# Altium schematic sheet ST1S40IDR.SchDoc
size A3; SheetNumber: 3; SheetTotal: 7
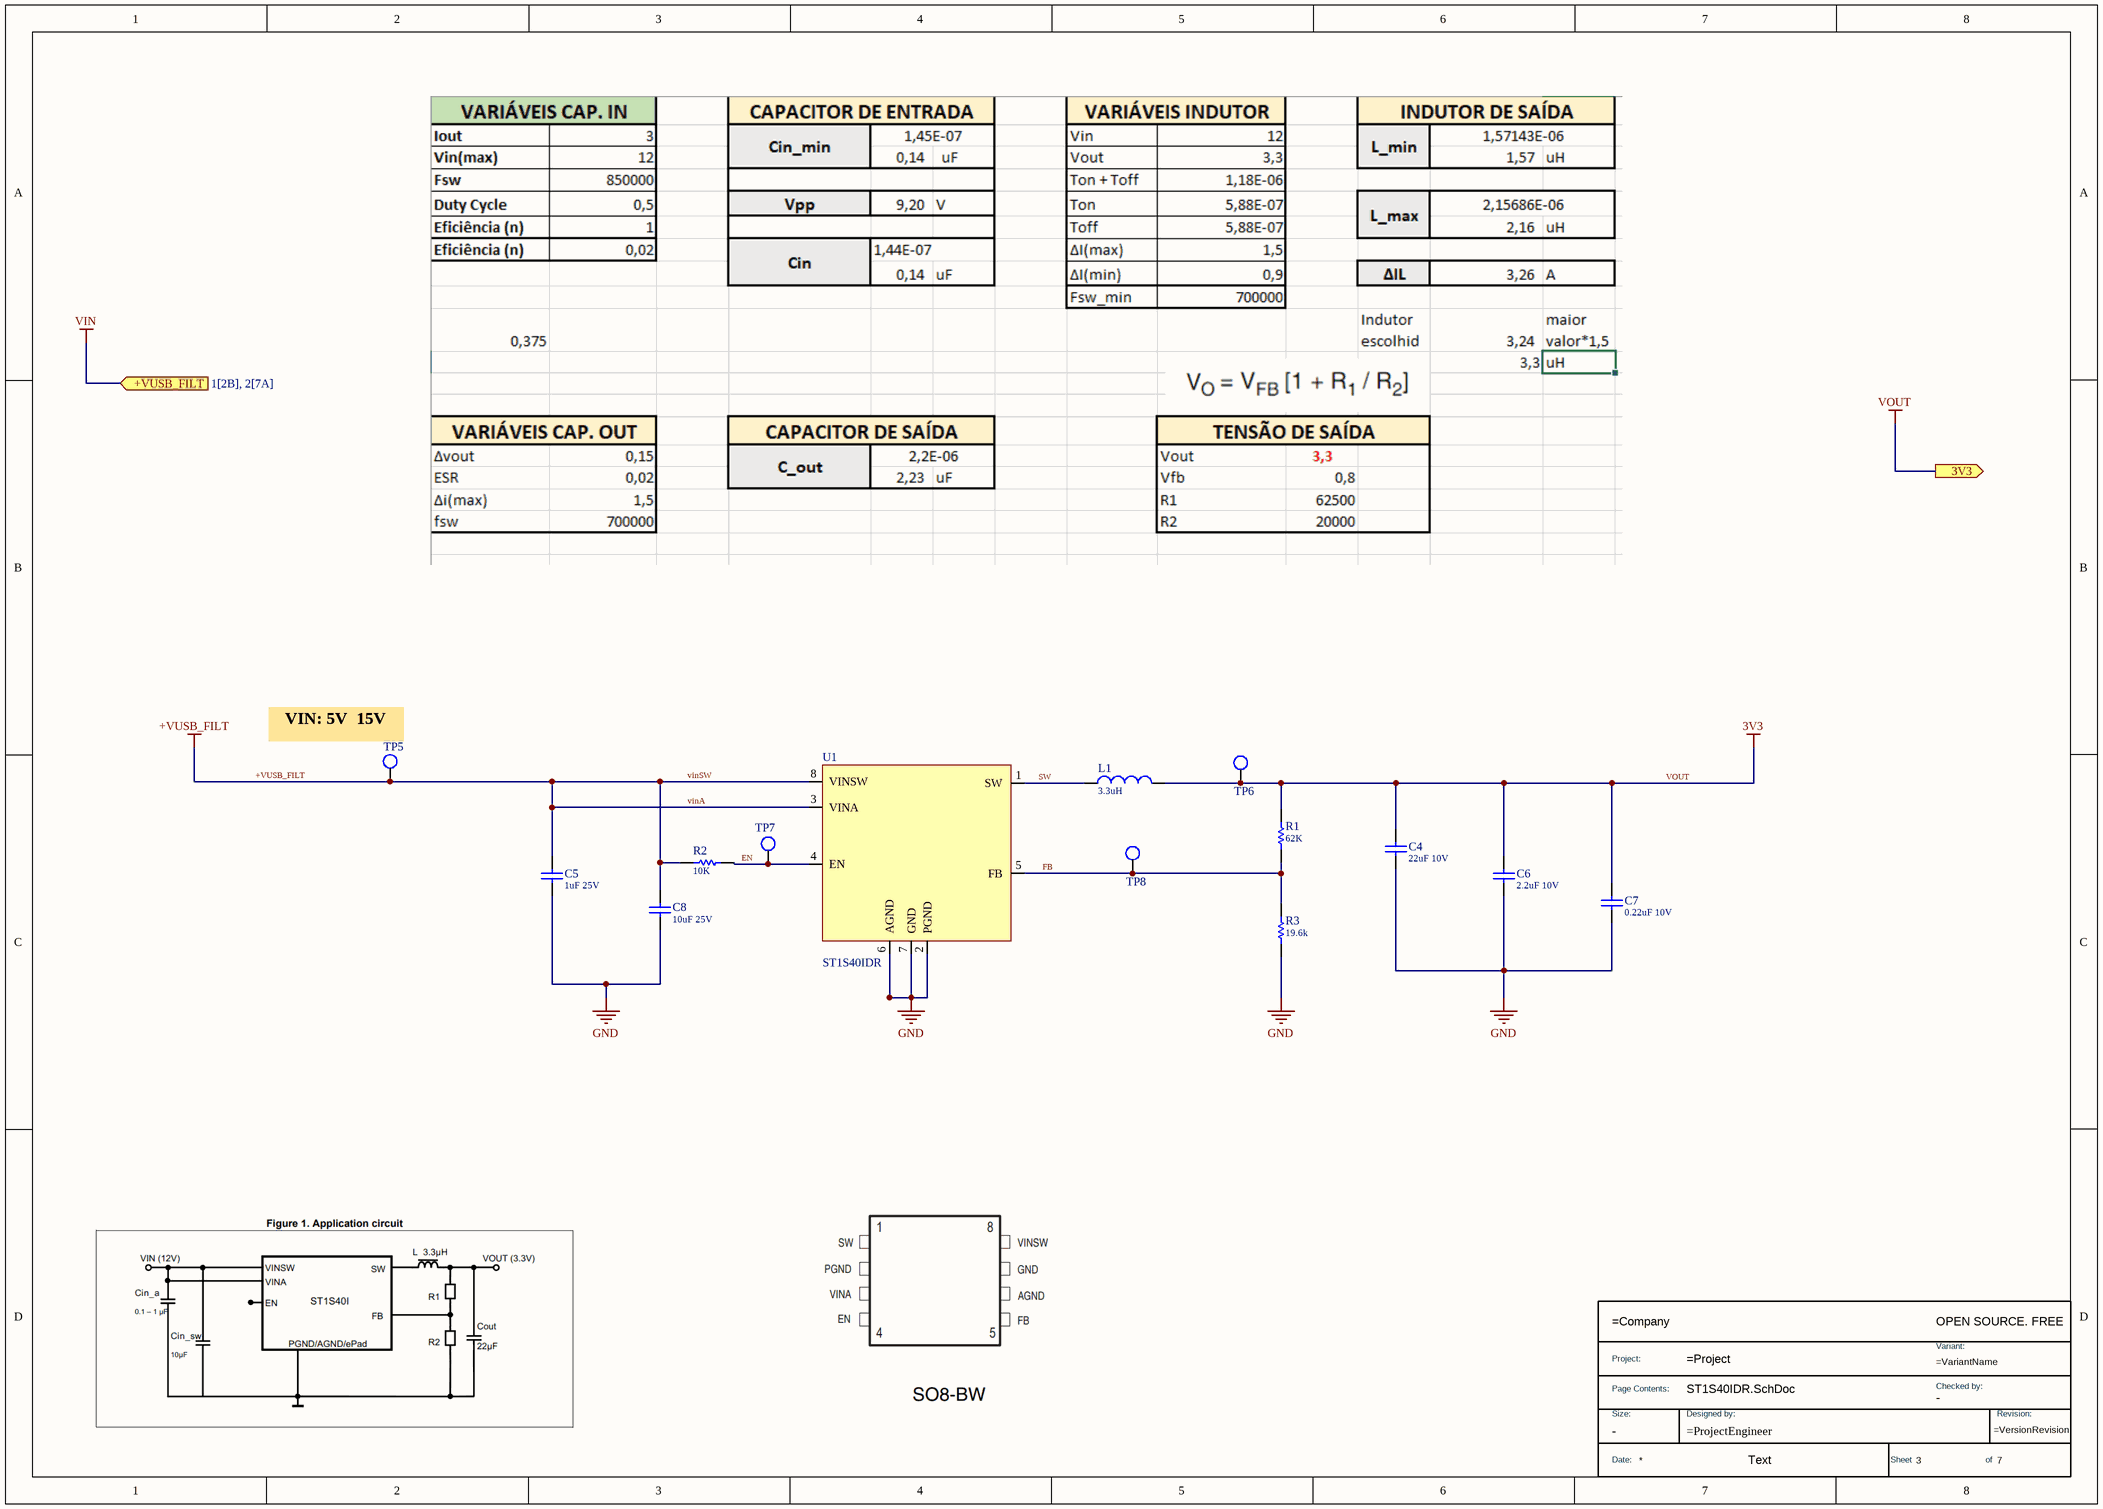
[diagram p0: ST1S40IDR.SchDoc]

## Parts
*  TitleBlock  (value not drawn)  (graphical)
C4  Valor: 22uF 10V  [0805]  (hidden comment: CL21A226MPQNNNE)
C5  Valor: 1uF 25V  [CAP_0805]  (hidden comment: CL21B105KAFNNNE)
C6  Valor: 2.2uF 10V  [0805]  (hidden comment: CL21B225KAFNNNE)
C7  Valor: 0.22uF 10V  [0805]  (hidden comment: CC0805KRX7R6BB224)
C8  Valor: 10uF 25V  [CAP_0805]  (hidden comment: CL21A106KAYNNNE)
L1  value 3.3uH  [IND_6.1-4]  (hidden comment: VLS5045EX-3R3N-H)
R1  Valor: 62K  [RES_0805]  (hidden comment: CRCW080562K0JNEA)
R2  Valor: 10K  [RES_0805]  (hidden comment: AF0805JR-0710KL)
R3  Valor: 19.6k  [RES_0805]  (hidden comment: RT0805BRD0719K6L)
TP5  TEST_POINT_1.5MM  [TESTPOINT_1.5MM]  (value not drawn)  (no BOM)
TP6  TEST_POINT_1.5MM  [TESTPOINT_1.5MM]  (value not drawn)  (no BOM)
TP7  TEST_POINT_1.5MM  [TESTPOINT_1.5MM]  (value not drawn)  (no BOM)
TP8  TEST_POINT_1.5MM  [TESTPOINT_1.5MM]  (value not drawn)  (no BOM)
U1  ST1S40IDR  [SO8-BW]

## Ports
3V3 (out, see 1[3B], 4[1A], 5[1B], 6[1A], 7[1A]), +VUSB_FILT (in, see 1[2B], 2[7A])

## Nets
+VUSB_FILT: C5.2 C8.1 R2.1 TP5.1 U1.3(VINA) U1.8(VINSW)  [also labelled vinA, vinSW]
GND: C4.1 C5.1 C6.1 C7.1 C8.2 R3.1 U1.2(PGND) U1.6(AGND) U1.7(GND)
VIN: port +VUSB_FILT
VOUT: C4.2 C6.2 C7.2 L1.2 R1.2 TP6.1 ; port 3V3  [also labelled 3V3]
EN: R2.2 TP7.1 U1.4(EN)
FB: R1.1 R3.2 TP8.1 U1.5(FB)
SW: L1.1 U1.1(SW)

## Notes on the sheet
- (near TP5) VIN: 5V  15V
- Todas as informações e detalhes técnicos deste documento são de inteira propriedade da empresa V2COM,
- não poderão ser copiados, reduzidos ou cedidos a terceiros sem prévia autorização por escrito da mesma.
- Salvo em (D/M/A):
- Página:
- de
- Nome do Projeto:
- https://v2com.com/
- Ed.:
- Responsável:
- Nome da página:
- Rev.:
- Projetista:
- Obs.:
- Revisor:
- Arquivo:
- -
- (in symbol TitleBlock) OPEN SOURCE. FREE; Project:; Variant:; Page Contents:; Checked by:; Size:; Designed by:; Revision:; Date:; Text; Sheet; of

## Library data of the parts
* = TitleBlock: Standard Title Block; DWG NO: =ProjectEngineer; Size: -; Checked by: -
C4 = CL21A226MPQNNNE: CAP CER 22UF 10V X5R 0805; Manufacturer: Samsung Electro-Mechanics; Origem: OBDH_Ed02; Case/Package: 0805; Manufacturer Part Number: CL21A226MPQNNNE; Observação: *
C5 = CL21B105KAFNNNE: CAP CER 1UF 25V X7R 0805; Manufacturer: Samsung Electro-Mechanics; Origem: OBDH_Ed02; Case/Package: 0805; Manufacturer Part Number: CL21B105KAFNNNE; Observação: *
C6 = CL21B225KAFNNNE: CAP CER 2.2UF 10V X5R 0805; Manufacturer: Samsung Electro-Mechanics; Origem: OBDH_Ed02; Case/Package: 0805; Manufacturer Part Number: CL21B225KAFNNNE; Observação: *
C7 = CC0805KRX7R6BB224: CAP CER 0.22uF 10V X5R 0805; Manufacturer: YAGEO; Origem: OBDH_Ed02; Case/Package: 0805; Manufacturer Part Number: CC0805KRX7R6BB224; Observação: *
C8 = CL21A106KAYNNNE: CAP CER 10UF 25V X5R 0805; Manufacturer: Samsung Electro-Mechanics; Origem: OBDH_Ed02; Case/Package: 0805; Manufacturer Part Number: CL21A106KAYNNNE; Observação: *
L1 = VLS5045EX-3R3N-H: FIXED IND 3.3UH 4.2A 35.1MOHM SM; Case/Package: *; Manufacturer: *; Manufacturer Part Number: VLS5045EX-3R3N-H; Origem: *; Observação: *
R1 = CRCW080562K0JNEA: RES SMD 62K OHM 5% 1/8W 0805; Manufacturer: YAGEO; Case/Package: 0805; Manufacturer Part Number: CRCW080562K0JNEA; Origem: *; Observação: *
R2 = AF0805JR-0710KL: RES SMD 10K OHM 5% 1/8W 0805; Manufacturer: YAGEO; Case/Package: 0805; Manufacturer Part Number: AF0805JR-0710KL; Origem: *; Observação: *
R3 = RT0805BRD0719K6L: RES SMD 19.6K OHM 5% 1/8W 0805; Manufacturer: YAGEO; Case/Package: 0805; Manufacturer Part Number: RT0805BRD0719K6L; Origem: *; Observação: *
TP5-TP8 = TEST_POINT_1.5MM: TEST_POINT; Origem: -; Case/Package: SMD; Manufacturer: -; Manufacturer Part Number: TEST_POINT; Observação: *; Valor: *
U1 = ST1S40IDR: IC REG BUCK ADJUSTABLE 3A 8SO; Case/Package: *; Manufacturer: *; Manufacturer Part Number: *; Origem: *; Observação: *; Valor: *